# Altium schematic sheet TMC2100 V1.3.SchDoc: SilentStepStick-TMC2100_v12
size A4; Date: 2017/5/8 15:31:14; SheetNumber: 1
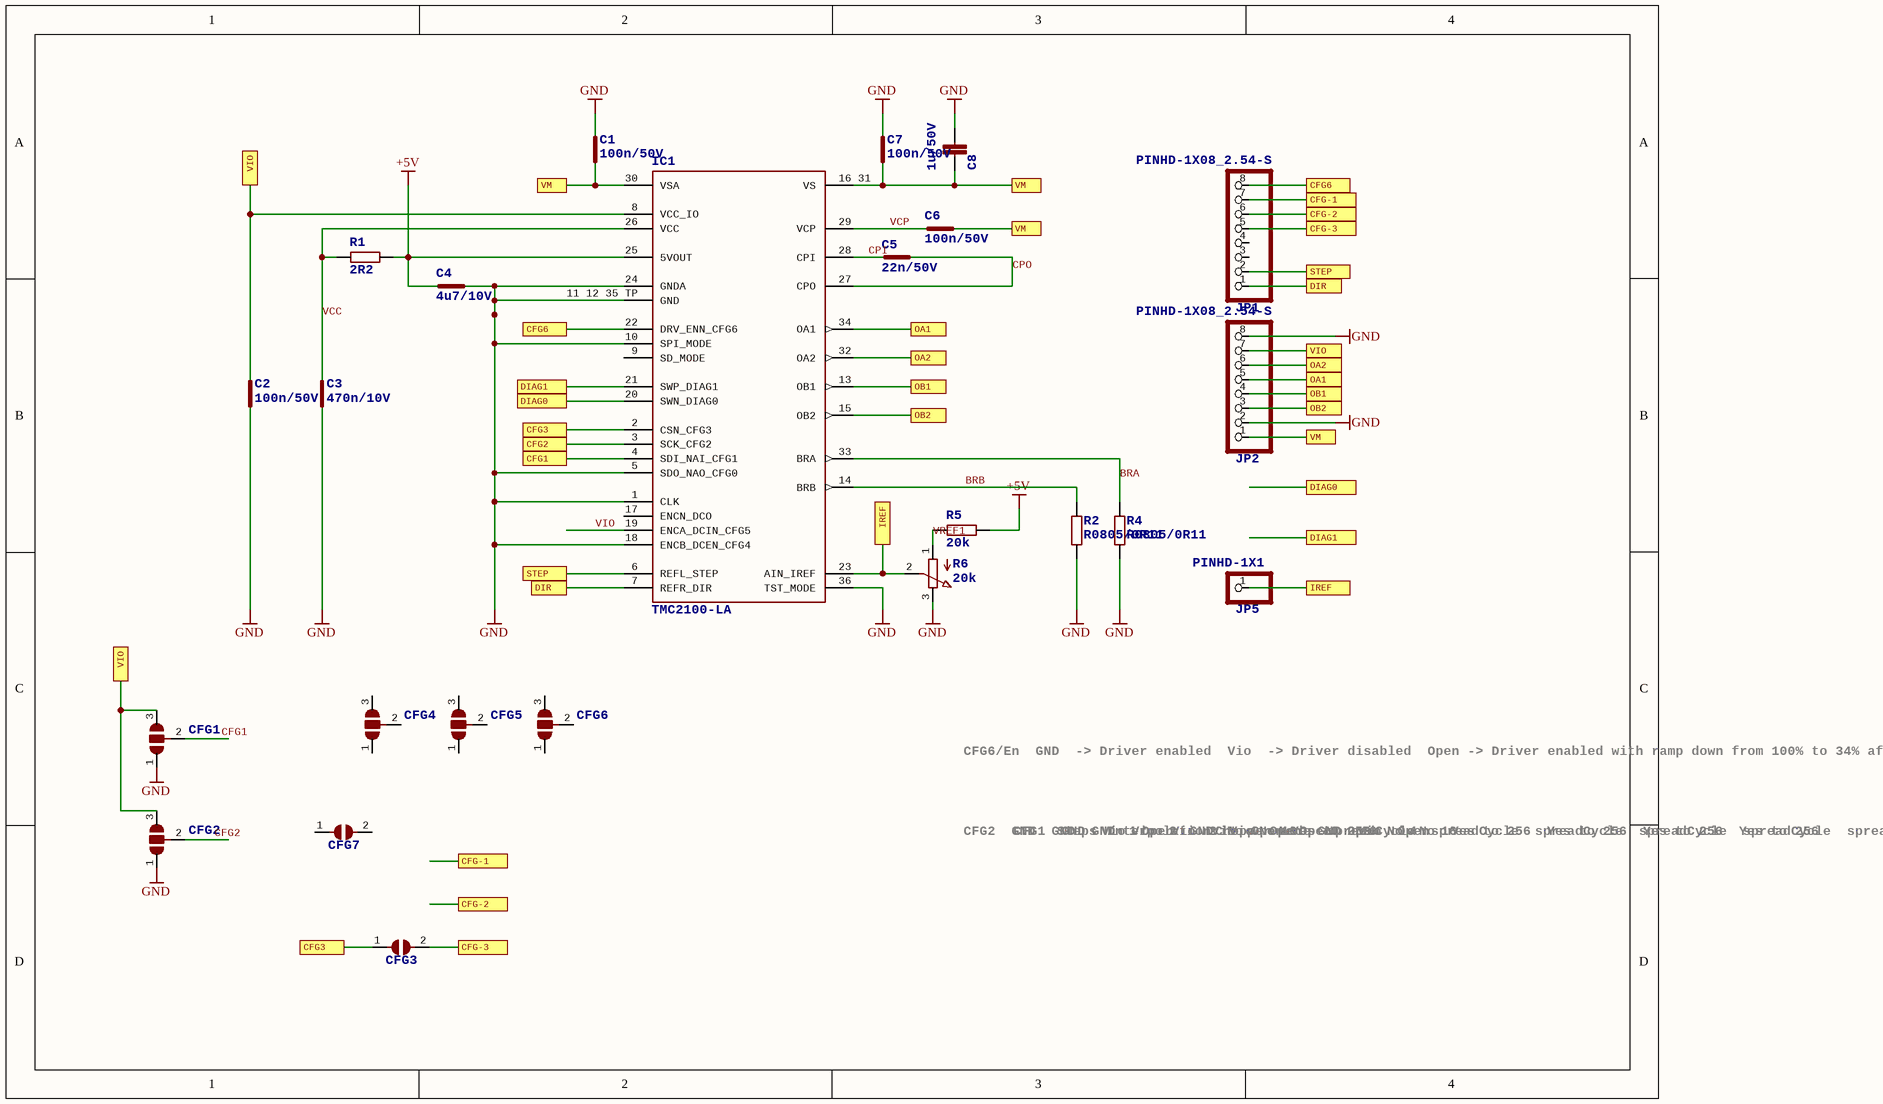
[diagram p0: TMC2100 V1.3.SchDoc]

## Parts
C1  100n/50V  [C0402]
C2  100n/50V  [C0402]
C3  470n/10V  [C0402]
C4  4u7/10V  [C0402]
C5  22n/50V  [C0402]
C6  100n/50V  [C0402]
C7  100n/50V  [C0402]
C8  1u/50V  [C0603]
CFG1  JUMPER3-0402  [JUMPER3-0402]  (value not drawn)
CFG2  JUMPER3-0402  [JUMPER3-0402]  (value not drawn)
CFG3  JUMPER2-0402  [JUMPER2-0402]  (value not drawn)
CFG4  JUMPER3-0201  [JUMPER3-0201]  (value not drawn)
CFG5  JUMPER3-0603  [JUMPER3-0603]  (value not drawn)
CFG6  JUMPER3-0603-NC  [JUMPER3-0603_NC]  (value not drawn)
CFG7  JUMPER2-0201  [JUMPER2-0201]  (value not drawn)
IC1  TMC2100-LA  [QFN36-PAD]
JP1  PINHD-1X08_2.54-S  [1X08-S]
JP2  PINHD-1X08_2.54-S  [1X08-S]
JP5  PINHD-1X1  [1X01]
R1  2R2  [C0402]
R2  R0805/0R11  [M0805]
R4  R0805/0R11  [M0805]
R5  20k  [C0402]
R6  20k  [POT_EVM3R]

## Ports
CFG1, CFG2, CFG3, CFG6, CFG-1, CFG-2, CFG-3, DIAG0, DIAG1, DIR, IREF, OA1, OA2, OB1, OB2, STEP, VIO, VM

## Nets
+5V: C4.2 IC1.25(5VOUT) R1.2 R5.2
GND: C1.2 C2.1 C3.1 C4.1 C7.2 C8.2 CFG1.1 CFG2.1 IC1.1(CLK) IC1.5(SDO_NAO_CFG0) IC1.10(SPI_MODE) IC1.11_12_35_TP(GND) IC1.18(ENCB_DCEN_CFG4) IC1.24(GNDA) IC1.36(TST_MODE) JP2.2 JP2.8 R2.1 R4.1 R6.3(E)
BRA: IC1.33(BRA) R4.2
BRB: IC1.14(BRB) R2.2
CFG1: CFG1.2
CFG1: IC1.4(SDI_NAI_CFG1) ; port CFG1  [a separate net that carries the same name]
CFG2: CFG2.2
CFG2: IC1.3(SCK_CFG2) ; port CFG2  [a separate net that carries the same name]
CFG3: CFG3.1 IC1.2(CSN_CFG3) ; port CFG3
CFG6: IC1.22(DRV_ENN_CFG6) JP1.8 ; port CFG6
CFG-1: JP1.7 ; port CFG-1
CFG-2: JP1.6 ; port CFG-2
CFG-3: CFG3.2 JP1.5 ; port CFG-3
CPI: C5.2 IC1.28(CPI)
CPO: C5.1 IC1.27(CPO)
DIAG0: IC1.20(SWN_DIAG0) ; port DIAG0
DIAG1: IC1.21(SWP_DIAG1) ; port DIAG1
DIR: IC1.7(REFR_DIR) JP1.1 ; port DIR
IREF: IC1.23(AIN_IREF) JP5.1 R6.2(S) ; port IREF
OA1: IC1.34(OA1) JP2.5 ; port OA1
OA2: IC1.32(OA2) JP2.6 ; port OA2
OB1: IC1.13(OB1) JP2.4 ; port OB1
OB2: IC1.15(OB2) JP2.3 ; port OB2
STEP: IC1.6(REFL_STEP) JP1.2 ; port STEP
VCC: C3.2 IC1.26(VCC) R1.1
VCP: C6.2 IC1.29(VCP)
VIO: C2.2 CFG1.3 CFG2.3 IC1.8(VCC_IO) JP2.7 ; port VIO
VIO: IC1.19(ENCA_DCIN_CFG5)  [a separate net that carries the same name]
VM: C1.1 C6.1 C7.1 C8.1 IC1.16_31(VS) IC1.30(VSA) JP2.1 ; port VM
VREF1: R5.1 R6.1(A)

Not connected (* = marked no-connect by the designer): CFG4 1 2 3; CFG5 1 2 3; CFG6 1 2 3; CFG7 1 2; IC1 9(SD_MODE) 17(ENCN_DCO); JP1 3 4

## Notes on the sheet
- CFG6/En
  GND  -> Driver enabled
  Vio  -> Driver disabled
  Open -> Driver enabled with ramp down from 100% to 34% after about 3s
- CFG2
  GND
  GND
  GND
  Vio
  Vio
  Vio
  Open
  Open
  Open
- CFG1
  GND
  Vio
  Open
  GND
  Vio
  Open
  GND
  Vio
  Open
- Steps
  1
  2
  2
  4
  16
  4
  16
  4
  16
- Interpolation
  No
  No
  Yes to 256
  No
  No
  Yes to 256
  Yes to 256
  Yes to 256
  Yes to 256
- Chopper Mode
  spreadCycle
  spreadCycle
  spreadCycle
  spreadCycle
  spreadCycle
  spreadCycle
  spreadCycle
  stealthChop
  stealthChop

## Library data of the parts
C1-C7 = CAPACITOR-0402: Capacitors  ...4.7uF @ 6.3V -> 0402 ...10uF @ 16V -> 0603 ...22uF @ 25V -> 0805
C8 = C-EUC0603: CAPACITOR, European symbol
CFG1 CFG2 = JUMPER3-0402: 3 Pin Jumpers
CFG3 = JUMPER2-0402: 2 Pin Jumpers
CFG4 = JUMPER3-0201: 3 Pin Jumpers
CFG5 = JUMPER3-0603: 3 Pin Jumpers
CFG6 = JUMPER3-0603-NC: 3 Pin Jumpers
CFG7 = JUMPER2-0201: 2 Pin Jumpers
IC1 = TMC21X0-LA: Trinamic TMC21x0 Stepper Motor Driver (5V...46V, 1.2A RMS, 256 microsteps)
JP1 JP2 = PINHD-1X08_2.54-S: PIN HEADER
JP5 = PINHD-1X1: PIN HEADER
R1 R5 = RESISTOR-0402: Resistors all kinds in 0603 and 0402
R2 R4 = R-EU_M0805: RESISTOR, European symbol
R6 = POTEVM3R: Potentiometer